# EAGLE design Logomatic-v23 (EAGLE 6.2)

## Sheet 1 of 2
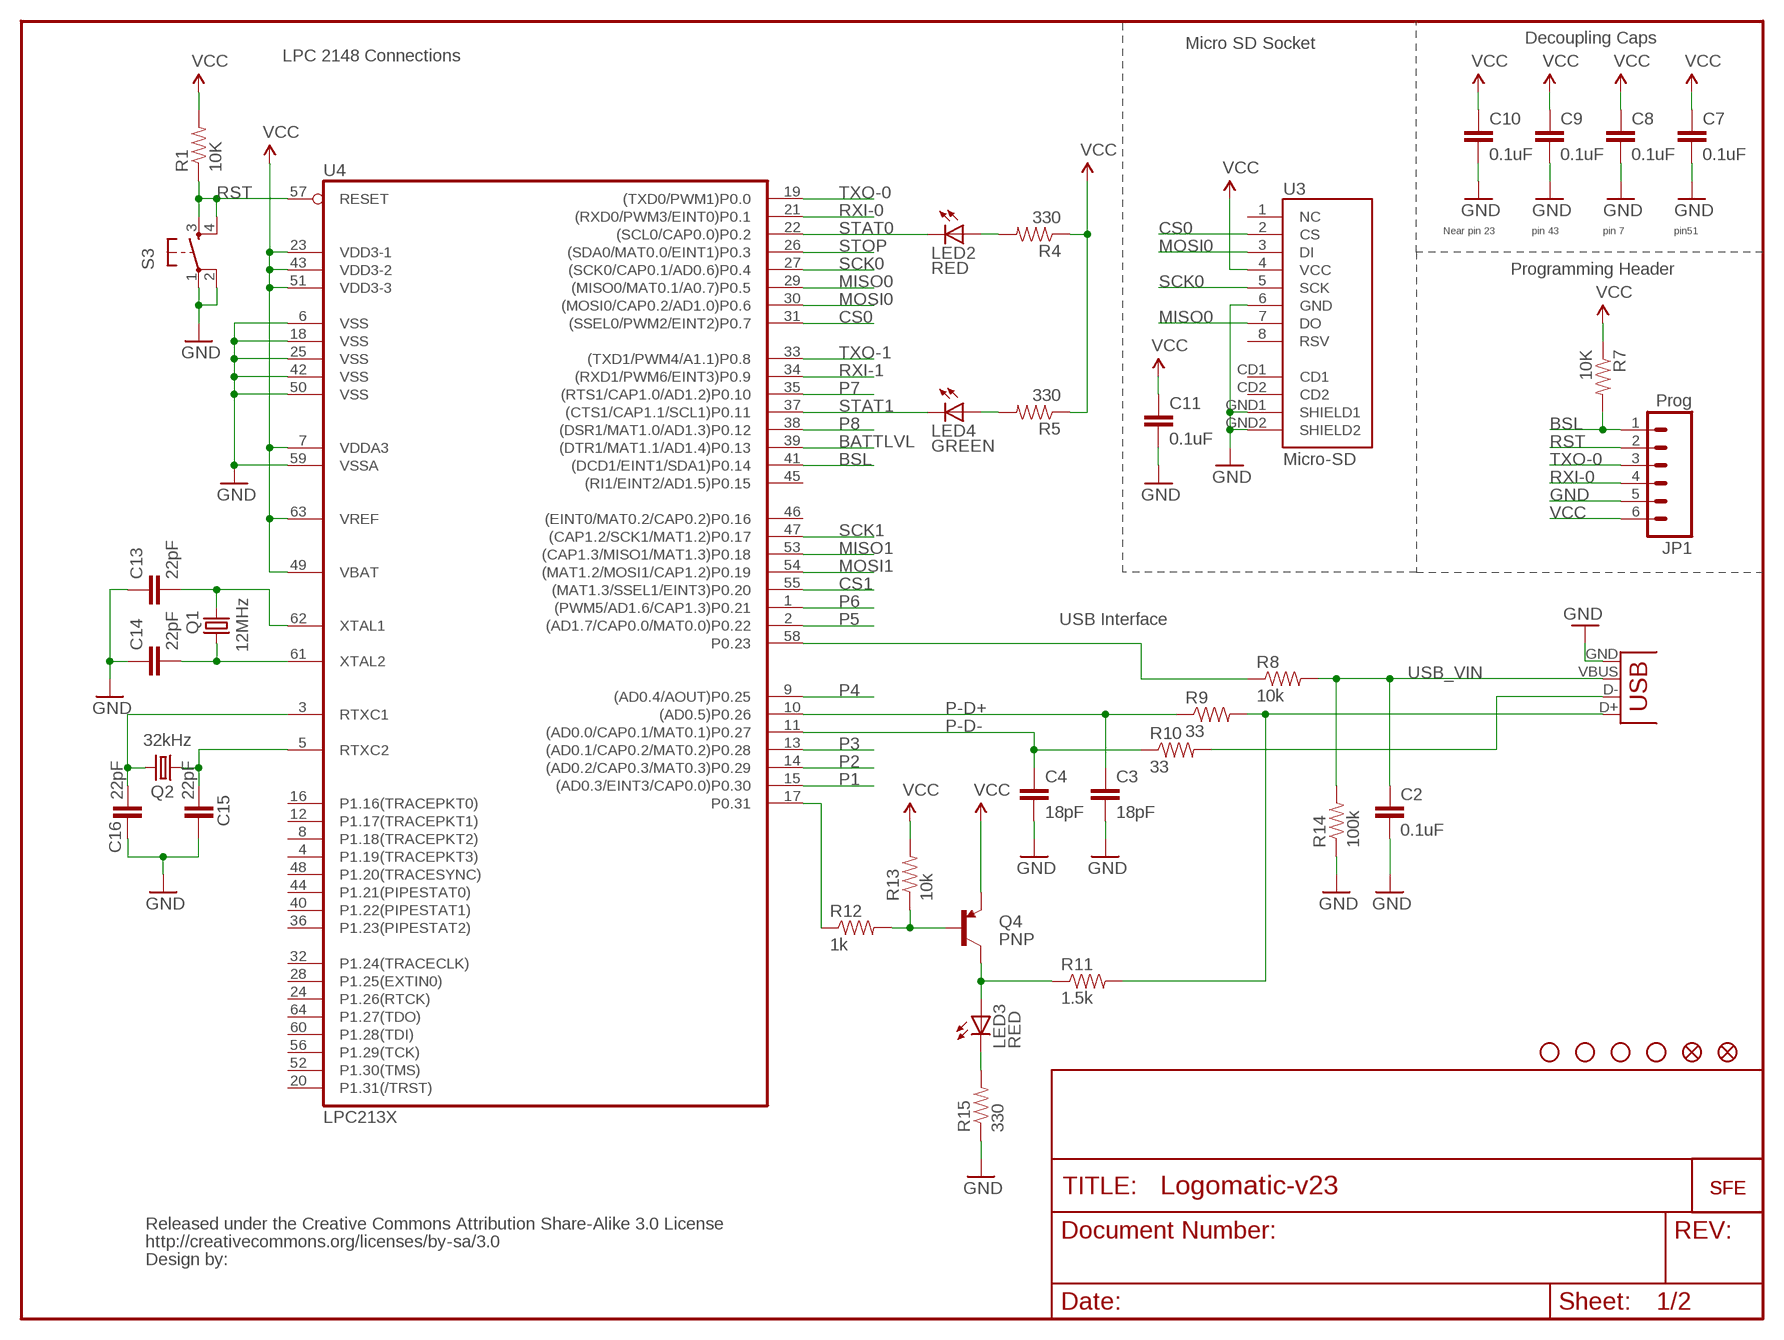
[diagram p0: schematic, sheet 1]

### Parts
C2  0.1uF  CAP0402  [C0402]
C3  18pF  CAP0402  [C0402]
C4  18pF  CAP0402  [C0402]
C7  0.1uF  CAP0402  [C0402]
C8  0.1uF  CAP0402  [C0402]
C9  0.1uF  CAP0402  [C0402]
C10  0.1uF  CAP0402  [C0402]
C11  0.1uF  CAP0402  [C0402]
C13  22pF  CAP0402  [C0402]
C14  22pF  CAP0402  [C0402]
C15  22pF  CAP0402  [C0402]
C16  22pF  CAP0402  [C0402]
JP1  Prog  M06SIP  [1X06]
LED2  RED  LED0603  [LED-0603]
LED3  RED  LED0603  [LED-0603]
LED4  GREEN  LED0603  [LED-0603]
Q1  12MHz  CRYSTAL5X3  [CRYSTAL-SMD-5X3]
Q2  32kHz  CRYSTAL32-SMD  [CRYSTAL-32KHZ-SMD]
Q4  PNP  TRANSISTOR_PNPSMD  [SOT23-3]
R1  10K  RESISTOR0402  [C0402]
R4  330  RESISTOR0402  [C0402]
R5  330  RESISTOR0402  [C0402]
R7  10K  RESISTOR0402  [C0402]
R8  10k  RESISTOR0402  [C0402]
R9  33  RESISTOR0402  [C0402]
R10  33  RESISTOR0402  [C0402]
R11  1.5k  RESISTOR0402  [C0402]
R12  1k  RESISTOR0402  [C0402]
R13  10k  RESISTOR0402  [C0402]
R14  100k  RESISTOR0402  [C0402]
R15  330  RESISTOR0402  [C0402]
S3  Reset  TAC_SWITCHSND  [TACTILE_SWITCH_SMD]
U3  Micro-SD  USD-SOCKETUSD  [USD-SOCKET-PP]
U4  LPC213X  [SQFP-S-10X10-64]
U$1  FIDUCIAL1X2  [FIDUCIAL-1X2]
U$2  FIDUCIAL1X2  [FIDUCIAL-1X2]
U$3  STAND-OFF  [STAND-OFF]
U$4  STAND-OFF  [STAND-OFF]
U$5  STAND-OFF  [STAND-OFF]
U$6  LOGO-SFENEW  [SFE-NEW-WEBLOGO]
U$7  LOGO-SFESK  [SFE-LOGO-FLAME]
U$8  STAND-OFF  [STAND-OFF]
U$9  CREATIVE_COMMONS  [CREATIVE_COMMONS]
X1  USBSMD  [USB-MINIB]

### Nets
BATTLVL: U4.39((DTR1/MAT1.1/AD1.4)P0.13) ; also sheet 2
BSL: JP1.1 R7.2 U4.41((DCD1/EINT1/SDA1)P0.14)
CS0: U3.2(CS) U4.31((SSEL0/PWM2/EINT2)P0.7)
CS1: U4.55((MAT1.3/SSEL1/EINT3)P0.20) ; also sheet 2
GND [power]: C2.2 C3.2 C4.2 C7.2 C8.2 C9.2 C10.2 C11.2 C13.1 C14.1 C15.1 C16.1 JP1.5 R14.1 R15.1 S3.1 S3.2 U3.6(GND) U3.GND1(SHIELD1) U3.GND2(SHIELD2) U4.6(VSS) U4.18(VSS) U4.25(VSS) U4.42(VSS) U4.50(VSS) U4.59(VSSA) X1.GND ; also sheet 2
MISO0: U3.7(DO) U4.29((MISO0/MAT0.1/A0.7)P0.5)
MISO1: U4.53((CAP1.3/MISO1/MAT1.3)P0.18) ; also sheet 2
MOSI0: U3.3(DI) U4.30((MOSI0/CAP0.2/AD1.0)P0.6)
MOSI1: U4.54((MAT1.2/MOSI1/CAP1.2)P0.19) ; also sheet 2
N$5: C13.2 Q1.3 U4.62(XTAL1)
N$6: C16.2 Q2.X2 U4.3(RTXC1)
N$7: LED2.A R4.2
N$9: C15.2 Q2.X1 U4.5(RTXC2)
N$16: R8.1 U4.58(P0.23)
N$17: Q4.1(B) R12.2 R13.1
N$19: LED4.A R5.2
N$21: C14.2 Q1.1 U4.61(XTAL2)
N$31: R12.1 U4.17(P0.31)
N$33: LED3.C R15.2
P1: U4.15((AD0.3/EINT3/CAP0.0)P0.30) ; also sheet 2
P2: U4.14((AD0.2/CAP0.3/MAT0.3)P0.29) ; also sheet 2
P3: U4.13((AD0.1/CAP0.2/MAT0.2)P0.28) ; also sheet 2
P4: U4.9((AD0.4/AOUT)P0.25) ; also sheet 2
P5: U4.2((AD1.7/CAP0.0/MAT0.0)P0.22) ; also sheet 2
P6: U4.1((PWM5/AD1.6/CAP1.3)P0.21) ; also sheet 2
P7: U4.35((RTS1/CAP1.0/AD1.2)P0.10) ; also sheet 2
P8: U4.38((DSR1/MAT1.0/AD1.3)P0.12) ; also sheet 2
P-D+: C3.1 R9.1 U4.10((AD0.5)P0.26)
P-D-: C4.1 R10.1 U4.11((AD0.0/CAP0.1/MAT0.1)P0.27)
RST: JP1.2 R1.1 S3.3 S3.4 U4.57(RESET)
RXI-0: JP1.4 U4.21((RXD0/PWM3/EINT0)P0.1)
RXI-1: U4.34((RXD1/PWM6/EINT3)P0.9) ; also sheet 2
SCK0: U3.5(SCK) U4.27((SCK0/CAP0.1/AD0.6)P0.4)
SCK1: U4.47((CAP1.2/SCK1/MAT1.2)P0.17) ; also sheet 2
STAT: LED3.A Q4.3(C) R11.1
STAT0: LED2.C U4.22((SCL0/CAP0.0)P0.2)
STAT1: LED4.C U4.37((CTS1/CAP1.1/SCL1)P0.11)
STOP: U4.26((SDA0/MAT0.0/EINT1)P0.3) ; also sheet 2
TXO-0: JP1.3 U4.19((TXD0/PWM1)P0.0)
TXO-1: U4.33((TXD1/PWM4/A1.1)P0.8) ; also sheet 2
USB_D+: R9.2 R11.2 X1.D+
USB_D-: R10.2 X1.D-
USB_VIN: C2.1 R8.2 R14.2 X1.VBUS ; also sheet 2
VCC: C7.1 C8.1 C9.1 C10.1 C11.1 JP1.6 Q4.2(E) R1.2 R4.1 R5.1 R7.1 R13.2 U3.4(VCC) U4.7(VDDA3) U4.23(VDD3-1) U4.43(VDD3-2) U4.49(VBAT) U4.51(VDD3-3) U4.63(VREF) ; also sheet 2
Unconnected: U3.1(NC) U3.8(RSV) U3.CD1 U3.CD2 U4.4(P1.19(TRACEPKT3)) U4.8(P1.18(TRACEPKT2)) U4.12(P1.17(TRACEPKT1)) U4.16(P1.16(TRACEPKT0)) U4.20(P1.31(/TRST)) U4.24(P1.26(RTCK)) U4.28(P1.25(EXTIN0)) U4.32(P1.24(TRACECLK)) U4.36(P1.23(PIPESTAT2)) U4.40(P1.22(PIPESTAT1)) U4.44(P1.21(PIPESTAT0)) U4.45((RI1/EINT2/AD1.5)P0.15) U4.46((EINT0/MAT0.2/CAP0.2)P0.16) U4.48(P1.20(TRACESYNC)) U4.52(P1.30(TMS)) U4.56(P1.29(TCK)) U4.60(P1.28(TDI)) U4.64(P1.27(TDO))

### Notes on the sheet
- Decoupling Caps
- Micro SD Socket
- LPC 2148 Connections
- Near pin 23 | pin 43 | pin 7 | pin51
- Programming Header
- USB Interface

## Sheet 2 of 2
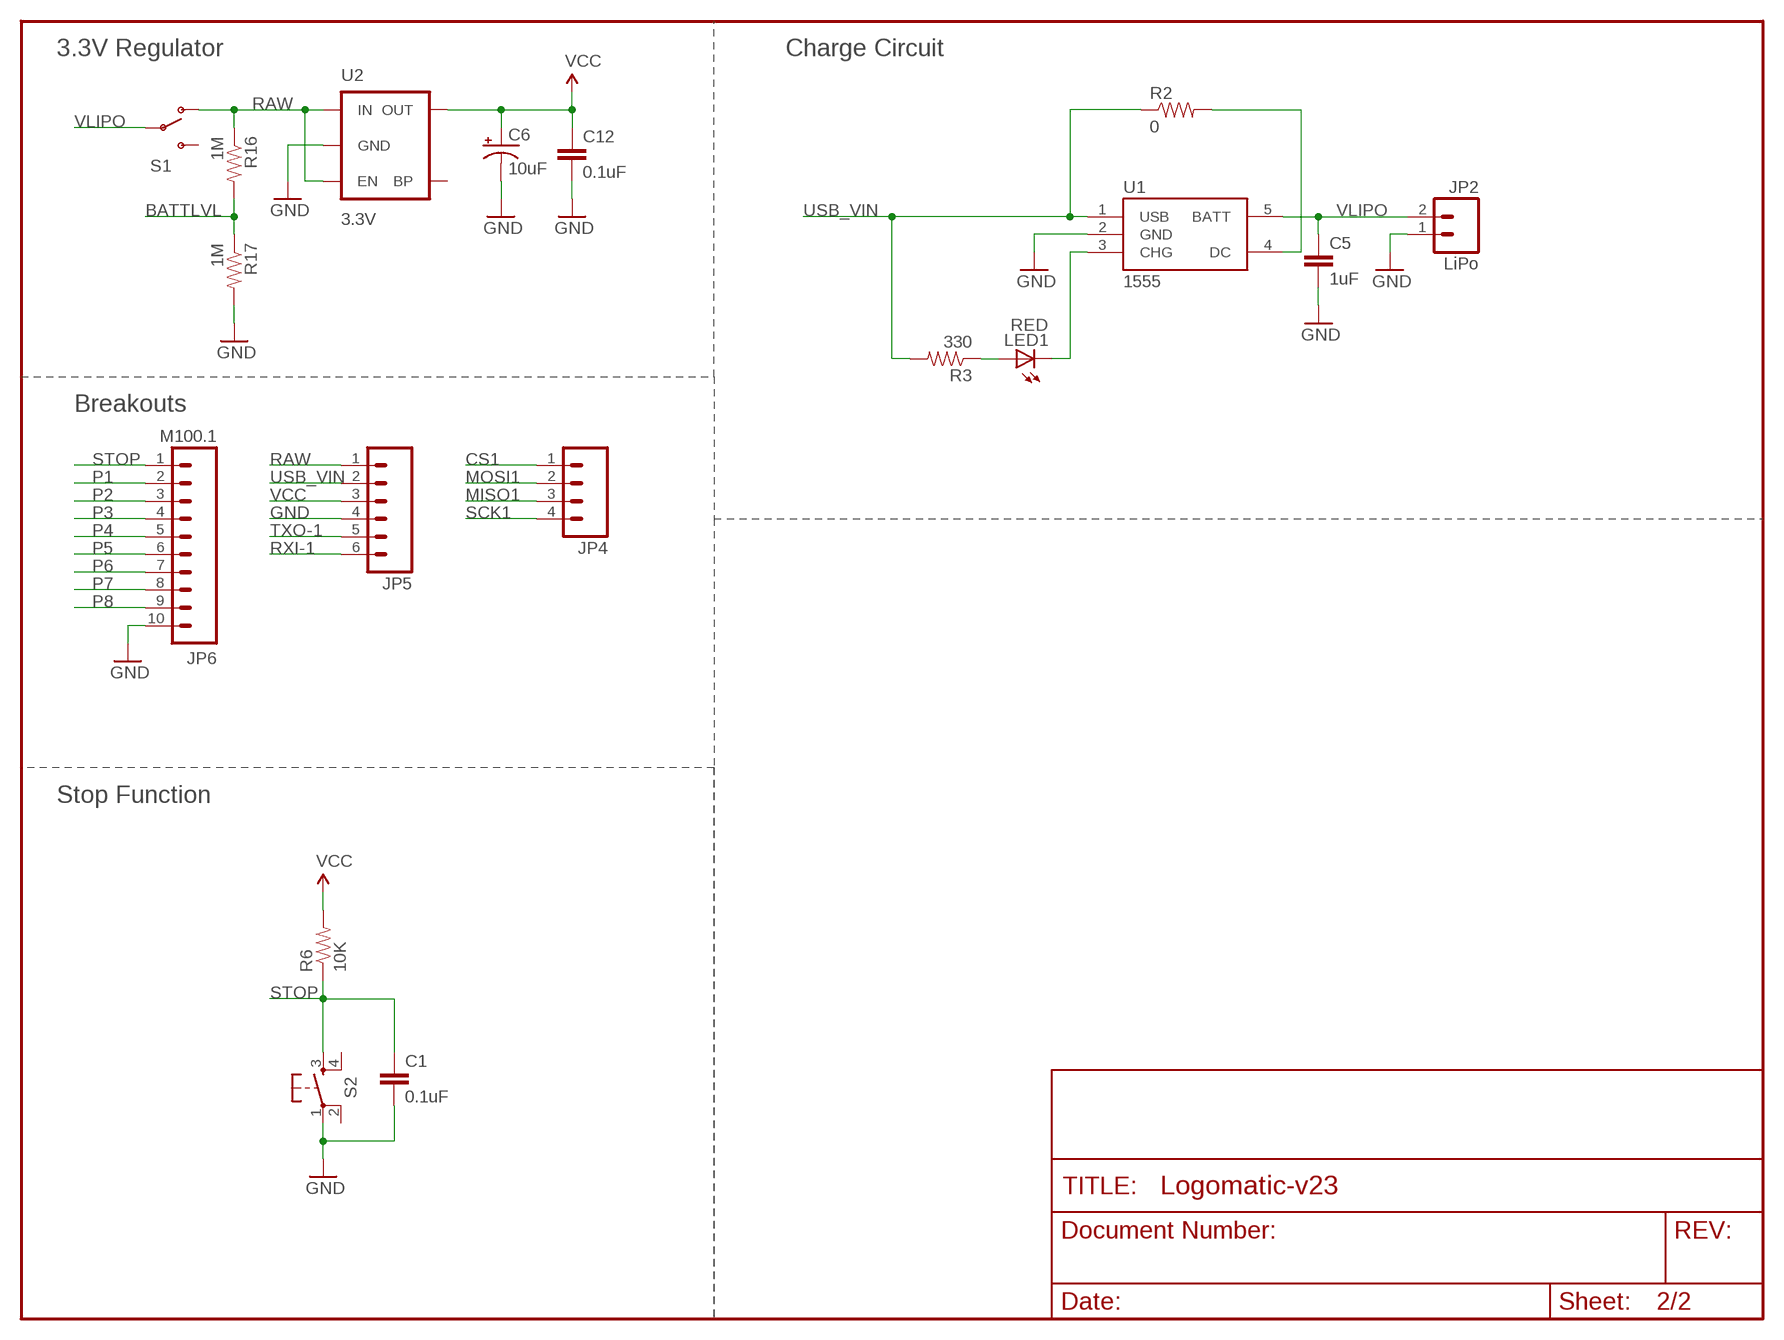
[diagram p1: schematic, sheet 2]

### Parts
C1  0.1uF  CAP0402  [C0402]
C5  1uF  CAP0402  [C0402]
C6  10uF  CAP_POL1206  [EIA3216]
C12  0.1uF  CAP0402  [C0402]
JP2  LiPo  M02-JST-2MM-SMT  [S2B-PH]
JP4  M04PTH  [1X04]
JP5  M06SIP  [1X06]
JP6  M100.1  [1X10]
LED1  RED  LED0603  [LED-0603]
R2  0  RESISTOR0402  [C0402]
R3  330  RESISTOR0402  [C0402]
R6  10K  RESISTOR0402  [C0402]
R16  1M  RESISTOR0402  [C0402]
R17  1M  RESISTOR0402  [C0402]
S1  SWITCH-SPSTSMD  [AYZ0202]
S2  Stop  TAC_SWITCHSND  [TACTILE_SWITCH_SMD]
U1  1555  MAX1555  [SOT23-5]
U2  3.3V  V_REG_LDOSMD  [SOT23-5]

### Nets
BATTLVL: R16.2 R17.1 ; also sheet 1
CS1: JP4.1 ; also sheet 1
GND [power]: C1.2 C5.2 C6.C(-) C12.2 JP2.1 JP5.4 JP6.10 R17.2 S2.1 U1.2(GND) U2.2(GND) ; also sheet 1
MISO1: JP4.3 ; also sheet 1
MOSI1: JP4.2 ; also sheet 1
N$2: R2.2 U1.4(DC)
N$12: LED1.C U1.3(CHG)
N$13: LED1.A R3.1
P1: JP6.2 ; also sheet 1
P2: JP6.3 ; also sheet 1
P3: JP6.4 ; also sheet 1
P4: JP6.5 ; also sheet 1
P5: JP6.6 ; also sheet 1
P6: JP6.7 ; also sheet 1
P7: JP6.8 ; also sheet 1
P8: JP6.9 ; also sheet 1
RAW: JP5.1 R16.1 S1.1(O) U2.1(IN) U2.3(EN)
RXI-1: JP5.6 ; also sheet 1
SCK1: JP4.4 ; also sheet 1
STOP: C1.1 JP6.1 R6.1 S2.3 ; also sheet 1
TXO-1: JP5.5 ; also sheet 1
USB_VIN: JP5.2 R2.1 R3.2 U1.1(USB) ; also sheet 1
VCC: C6.A(+) C12.1 JP5.3 R6.2 U2.5(OUT) ; also sheet 1
VLIPO [power]: C5.1 JP2.2 S1.2(P) U1.5(BATT)
Unconnected: S1.3(S) S2.2 S2.4 U2.4(BP)

### Notes on the sheet
- 3.3V Regulator | Charge Circuit
- Breakouts
- Stop Function

## Library data of the parts
C1-C4 C7-C16 = SparkFunEagle-6-6-07:CAP: Capacitor Standard 0603 ceramic capacitor, and 0.1" leaded capacitor.
C5 = SparkFun:CAP: Capacitor Standard 0603 ceramic capacitor, and 0.1" leaded capacitor.
C6 = SparkFun:CAP_POL: Capacitor Polarized These are standard SMD and PTH capacitors. Normally 10uF, 47uF, and 100uF in electrolytic and tantalum varieties. Always verify the external diameter of the through hole cap, it varies with capacity, voltage, and manufacturer. The EIA devices should be standard.
JP1 JP5 = SparkFun:M06: Header 6 Standard 6-pin 0.1" header. Use with straight break away headers (SKU : PRT-00116), right angle break away headers (PRT-00553), swiss pins (PRT-00743), machine pins (PRT-00117), and female headers (PRT-00115). Molex polarized connector foot print use with SKU : PRT-08094 with associated crimp pins and housings.
JP2 = SparkFun:M02: Header 2 Standard 2-pin 0.1" header. Use with straight break away headers (SKU : PRT-00116), right angle break away headers (PRT-00553), swiss pins (PRT-00743), machine pins (PRT-00117), and female headers (PRT-00115). Molex polarized connector foot print use with SKU : PRT-08233 with associated crimp pins and housings.
JP4 = SparkFun:M04: Header 4 Standard 4-pin 0.1" header. Use with straight break away headers (SKU : PRT-00116), right angle break away headers (PRT-00553), swiss pins (PRT-00743), machine pins (PRT-00117), and female headers (PRT-00115). Molex polarized connector foot print use with SKU : PRT-08231 with associated crimp pins and housings.
JP6 = SparkFun:M10: Header 10 Standard 10-pin 0.1" header. Use with straight break away headers (SKU : PRT-00116), right angle break away headers (PRT-00553), swiss pins (PRT-00743), machine pins (PRT-00117), and female headers (PRT-00115).
LED1 = SparkFun:LED: LEDs Standard schematic elements and footprints for 5mm, 3mm, 1206, and 0603 sized LEDs. 5mm - Spark Fun Electronics SKU : COM-00529 (and others)
LED2 LED4 = SparkFunEagle-6-6-07:LED: LEDs Standard schematic elements and footprints for 5mm, 3mm, 1206, and 0603 sized LEDs. 5mm - Spark Fun Electronics SKU : COM-00529 (and others)
LED3 = SparkFun_Master:LED
Q1 = SparkFunEagle-6-6-07:CRYSTAL: Crystals Various standard crystals. Proven footprints. Spark Fun Electronics SKU : COM-00534
Q2 = SparkFun:CRYSTAL: Crystals Various standard crystals. Proven footprints. Spark Fun Electronics SKU : COM-00534
Q4 = SparkFun:TRANSISTOR_PNP
R1 R4-R15 = SparkFunEagle-6-6-07:RESISTOR: Resistor Basic schematic elements and footprints for 0603, 1206, and PTH 1/10th watt (small) resistors.
R2 R3 R16 R17 = SparkFun:RESISTOR: Resistor Basic schematic elements and footprints for 0603, 1206, and PTH 1/10th watt (small) resistors.
S1 = SparkFun:SWITCH-SPST: SPST Switch Simple slide switch. Spark Fun Electronics SKU : COM-00102
S2 S3 = SparkFunEagle-6-6-07:TAC_SWITCH: Momentary Switch Button commonly used for reset or general input. Spark Fun Electronics SKU : COM-00097
U1 = SparkFun:MAX1555: MAX1555 Lithium Charger IC SOT-23 Lithium Polymer charging IC. Schematic element and footprint proven. Spark Fun Electronics SKU : COM-00674
U2 = SparkFun:V_REG_LDO: Voltage Regulator LDO Standard 150mA LDO voltage regulator in SOT-23 layout. Micrel part MIC5205. BP (by-pass) pin is used to lower output noise with 470pF cap.
U3 = SparkFun:USD-SOCKET: microSD Socket Push-push type uSD socket. Schematic element and footprint production proven. Spark Fun Electronics SKU : PRT-00127. tDoc lines correctly indicate media card edge positions when inserting (unlocked, locked, depressed).
U4 = SparkFun:LPC213X: LPC213x Schematic element and footprint for NXP LPC213x. Spark Fun Electronics SKU : COM-00520
U$1 U$2 = SparkFun:FIDUCIAL: Fiducial Alignment Points Various fiducial points for machine vision alignment.
U$3-U$5 U$8 = SparkFun:STAND-OFF: Stand Off This is the mechanical footprint for a #4 phillips button head screw. Use the keepout ring to avoid running the screw head into surrounding components. SKU : PRT-00447
U$6 U$7 = SparkFun:LOGO-SFE: Spark Fun Electronics PCB Logo This is the standard Spark Fun Electronics PCB logo.
U$9 = SparkFun:CREATIVE_COMMONS
X1 = SparkFun:USB: USB Connectors USB-B-PTH is fully proven SKU : PRT-00139 USB-miniB is fully proven SKU : PRT-00587 USB-A-PCB is untested. USB-A-H is throughly reviewed, but untested. Spark Fun Electronics SKU : PRT-00437 USB-B-SMT is throughly reviewed, but untested. Needs silkscreen touching up. USB-A-S has not been used/tested USB-MB-H has not been used/tested

## Net classes
0 default: width 0.178 mm
1 power: width 0.203 mm
2 hv: width 0.254 mm, clearance 0.229 mm

## Board
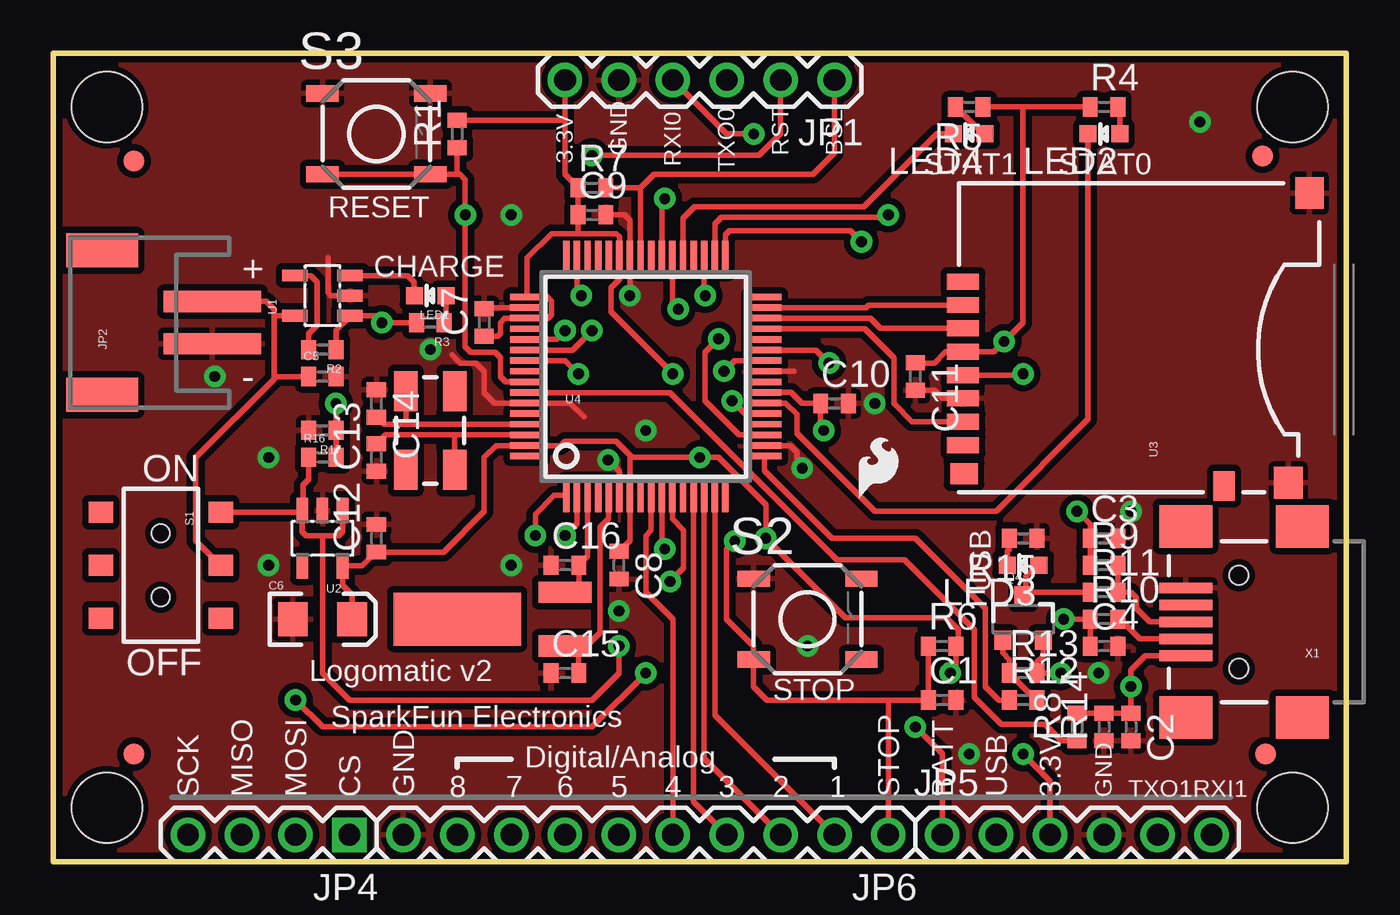
[diagram p2: board, top side]
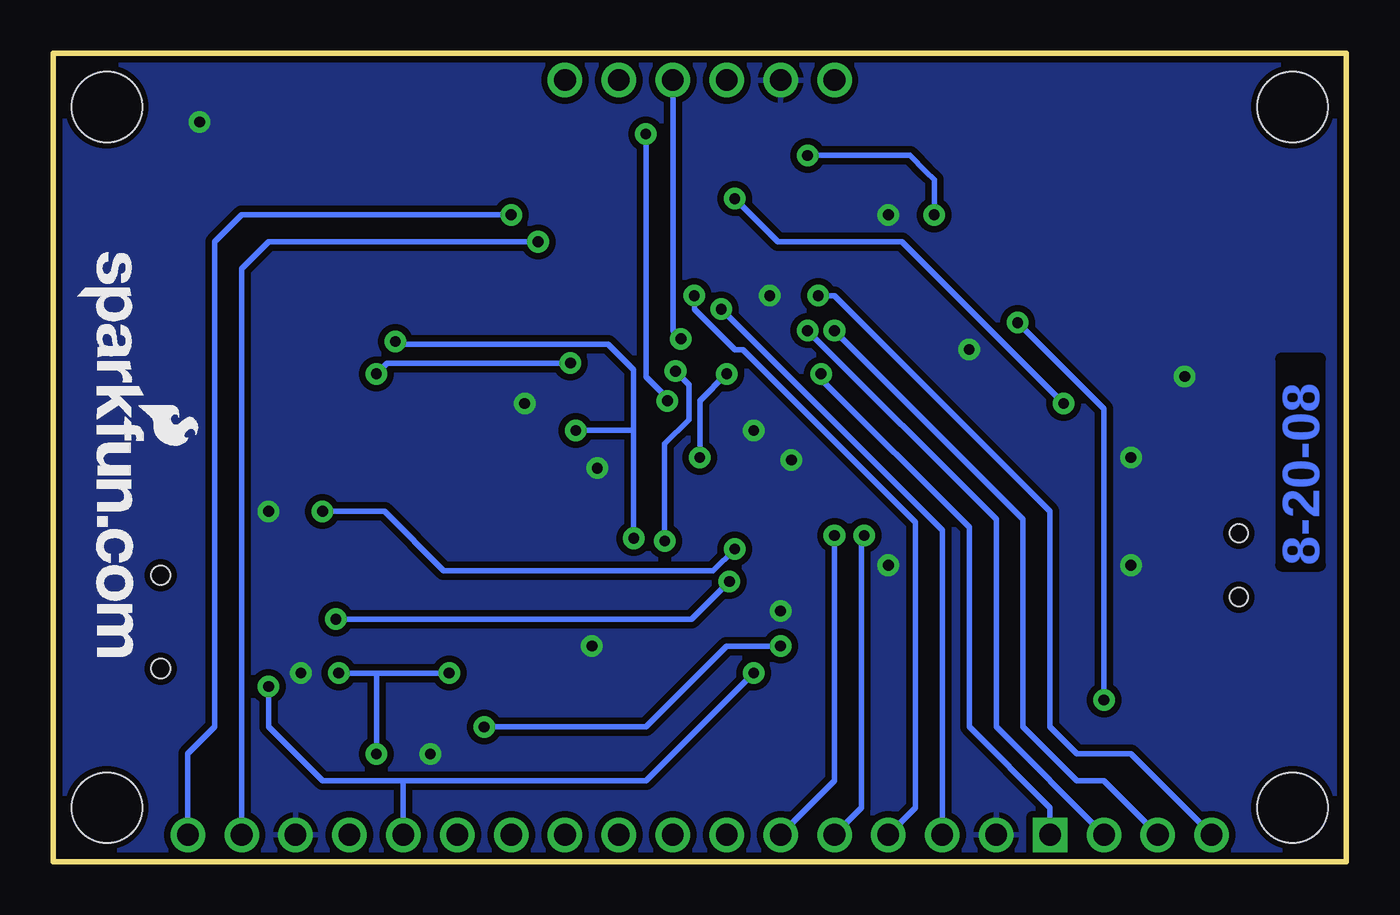
[diagram p3: board, bottom side, seen from below]

Size 60.96 x 38.1 mm. Coordinates in mm from the lower left corner, seen from the top.
Outline: 0,0 60.96,0 60.96,38.1 0,38.1 0,0
Copper layers (1*16): Top 0.035mm / dielectric 1.5mm / Bottom 0.035mm
Design rules: minimum track width 8mil, minimum drill 20mil, track to track 8mil, track to pad 8mil, pad to pad 7mil, via to via 8mil, smd to smd 8mil, copper to edge 10mil, drill to drill 8mil, minimum pad ring 12mil, minimum via ring 10mil, stop-mask expansion 4mil, vias tented up to drill 20mil, thermal gap 10mil

### Footprints (pad centres in the part's own frame; a part is rotated, then mirrored left to right if it is on the bottom)
C0402 = smd 0.7 x 0.9: 1 -0.65,0; 2 0.65,0
EIA3216 = smd 1.4 x 1.6: A 1.4,0; C -1.4,0
FIDUCIAL-1X2 = smd 1 x 1: 1 0,0
1X06 = drill 1.016: 1 0,0; 2 2.54,0; 3 5.08,0; 4 7.62,0; 5 10.16,0; 6 12.7,0
S2B-PH = smd 1 x 4.6: 1 -1,-3.7; 2 1,-3.7 | smd 1.6 x 3.4: NC1 -3.4,1.5; NC2 3.4,1.5
1X04 = drill 1.016 square: 1 0,0 | drill 1.016: 2 2.54,0; 3 5.08,0; 4 7.62,0
1X10 = drill 1.016: 1 0,0; 2 2.54,0; 3 5.08,0; 4 7.62,0; 5 10.16,0; 6 12.7,0; 7 15.24,0; 8 17.78,0; 9 20.32,0; 10 22.86,0
LED-0603 = smd 0.8 x 0.8: A 0,-0.75; C 0,0.75
CRYSTAL-SMD-5X3 = smd 1.9 x 1.1: 1 -1.85,-1.15; 2 1.85,-1.15; 3 1.85,1.15; 4 -1.85,1.15
CRYSTAL-32KHZ-SMD = smd 2.5 x 6: SHEILD 0,5.08 | smd 1 x 2.5: X1 -1.27,0; X2 1.27,0
SOT23-3 = smd 0.8 x 0.9: 1 -0.95,-1; 2 0.95,-1; 3 0,1.1
AYZ0202 = smd 1 x 1.15: 1 -2.5,2.825; 2 0,2.825; 3 2.5,2.825; 4 -2.5,-2.825; 5 0,-2.825; 6 2.5,-2.825 | hole 0.85: 1.5,0; -1.5,0
TACTILE_SWITCH_SMD = smd 1.524 x 0.762: 1 -2.54,1.905; 2 2.54,1.905; 3 -2.54,-1.905; 4 2.54,-1.905
SOT23-5 = smd 0.55 x 1.2: 1 -0.95,-1.3; 2 0,-1.3; 3 0.95,-1.3; 4 0.95,1.3; 5 -0.95,1.3
USD-SOCKET-PP = smd 0.75 x 1.5: 1 3.2,16.8; 2 2.1,16.8; 3 1,16.8; 4 -0.1,16.8; 5 -1.2,16.8; 6 -2.3,16.8; 7 -3.4,16.8; 8 -4.5,16.8 | smd 1 x 1.3: CD1 -5.85,16.75 | smd 1.4 x 1: CD2 -6.425,4.5 | smd 1.5 x 1.35: GND1 -6.275,1.475; GND2 7.375,0.475
SQFP-S-10X10-64 = smd 0.3 x 1.6: 1 -3.75,-5.6; 2 -3.25,-5.6; 3 -2.75,-5.6; 4 -2.25,-5.6; 5 -1.75,-5.6; 6 -1.25,-5.6; 7 -0.75,-5.6; 8 -0.25,-5.6; 9 0.25,-5.6; 10 0.75,-5.6; 11 1.25,-5.6; 12 1.75,-5.6; 13 2.25,-5.6; 14 2.75,-5.6; 15 3.25,-5.6; 16 3.75,-5.6; 33 3.75,5.6; 34 3.25,5.6; 35 2.75,5.6; 36 2.25,5.6; 37 1.75,5.6; 38 1.25,5.6; 39 0.75,5.6; 40 0.25,5.6; 41 -0.25,5.6; 42 -0.75,5.6; 43 -1.25,5.6; 44 -1.75,5.6; 45 -2.25,5.6; 46 -2.75,5.6; 47 -3.25,5.6; 48 -3.75,5.6 | smd 1.6 x 0.3: 17 5.6,-3.75; 18 5.6,-3.25; 19 5.6,-2.75; 20 5.6,-2.25; 21 5.6,-1.75; 22 5.6,-1.25; 23 5.6,-0.75; 24 5.6,-0.25; 25 5.6,0.25; 26 5.6,0.75; 27 5.6,1.25; 28 5.6,1.75; 29 5.6,2.25; 30 5.6,2.75; 31 5.6,3.25; 32 5.6,3.75; 49 -5.6,3.75; 50 -5.6,3.25; 51 -5.6,2.75; 52 -5.6,2.25; 53 -5.6,1.75; 54 -5.6,1.25; 55 -5.6,0.75; 56 -5.6,0.25; 57 -5.6,-0.25; 58 -5.6,-0.75; 59 -5.6,-1.25; 60 -5.6,-1.75; 61 -5.6,-2.25; 62 -5.6,-2.75; 63 -5.6,-3.25; 64 -5.6,-3.75
STAND-OFF = hole 3.302: 0,0
USB-MINIB = smd 2.5 x 0.5: D+ 2.5,0; D- 2.5,0.8; GND 2.5,-1.6; ID 2.5,-0.8; VBUS 2.5,1.6 | smd 2.5 x 2: GND@1 -3,-4.5; GND@2 -3,4.5; GND@3 2.5,4.5; GND@4 2.5,-4.5 | hole 0.9: 0,2.2; 0,-2.2

### Placement (x,y rotation side)
C1  41.91,7.62 0 top
C2  50.8,6.35 270 top
C3  49.53,15.24 0 top
C4  49.53,10.16 0 top
C5  12.7,22.86 0 top
C6  12.7,11.43 0 top
C7  20.32,25.4 90 top
C8  26.67,13.97 270 top
C9  25.4,30.48 0 top
C10  36.83,21.59 0 top
C11  40.64,22.86 270 top
C12  15.24,15.24 90 top
C13  15.24,19.05 90 top
C14  15.24,21.59 270 top
C15  24.13,8.89 0 top
C16  24.13,13.97 0 top
E$1  [FIDUCIAL-1X2]  57,33.25 0 top
E$2  [FIDUCIAL-1X2]  3.81,5.08 0 top
JP1  36.83,36.83 180 top
JP2  3.81,25.4 90 top
JP4  13.97,1.27 180 top
JP5  41.91,1.27 0 top
JP6  39.37,1.27 180 top
LED1  17.78,26.67 90 top
LED2  49.53,34.29 90 top
LED3  45.72,13.97 90 top
LED4  43.18,34.29 90 top
Q1  17.78,20.32 270 top
Q2  24.13,11.43 90 top
Q4  45.72,11.43 0 top
R1  19.05,34.29 90 top
R2  12.7,24.13 180 top
R3  17.78,25.4 180 top
R4  49.53,35.56 0 top
R5  43.18,35.56 180 top
R6  41.91,10.16 0 top
R7  25.4,31.75 0 top
R8  48.26,6.35 90 top
R9  49.53,13.97 0 top
R10  49.53,11.43 0 top
R11  49.53,12.7 0 top
R12  45.72,7.62 0 top
R13  45.72,8.89 0 top
R14  49.53,6.35 90 top
R15  45.72,15.24 180 top
R16  12.7,19.05 0 top
R17  12.7,20.32 180 top
S1  5.08,13.97 270 top
S2  35.56,11.43 0 top
S3  15.24,34.29 0 top
U1  12.7,26.67 90 top
U2  12.7,15.24 180 top
U3  59.69,24.13 90 top
U4  27.94,22.86 0 top
U$1  57.15,5.08 0 top
U$2  3.81,33.02 0 top
U$3  2.54,2.54 0 top
U$4  58.42,2.54 0 top
U$5  2.54,35.56 0 top
U$6  59.82,28.7 270 bottom
U$7  37.97,17.14 0 top
U$8  58.42,35.56 0 top
U$9  17.78,-12.7 0 top  (outside the outline)
X1  55.88,11.3 180 top

### Tracks (layer width: path | path; a pad name or v marks a point on that pad's centre or on a via)
BATTLVL  (via drill 0.51)
  Top 0.254: R16.2 13.35,20.3 13.34,20.32 R17.1 13.35,21.57 v13.34,21.59 | U4.39 28.69,31.1 v28.83,31.24
  Bottom 0.254: v28.83,31.24 26.8,29.21 20.95,29.21 v13.34,21.59
BSL
  Top 0.254: U4.41 27.69,28.45 27.69,31.75 | JP1.1 36.83,33.4 35.81,32.38 28.32,32.38 27.69,31.75 | 27.69,31.75 R7.2
CS0
  Top 0.254: U4.31 38.3,26.11 38.42,26.23 U3.2
CS1  (via drill 0.51)
  Top 0.254: U4.55 24.14,23.61 v24.77,22.99
  Bottom 0.254: JP4.1 13.97,2.54 17.78,6.35 17.78,15.75 24.77,22.73 v24.77,22.99
GND  (via drill 0.51)
  Top 0.254: U4.25 34.92,23.11 | v27.18,26.67 27.19,26.68 U4.42 27.19,30.21 26.92,30.48 C9.2 26.04,30.48 | C7.2 20.34,26.05 20.45,26.16 20.5,26.11 U4.50 | U1.2 13.08,26.67 12.95,26.8 12.95,28.45 | U4.6 26.69,18.39 26.42,18.67 | U4.18 34.75,19.61 35.05,19.3 35.05,18.8 v35.31,18.54 | 25.02,20.95 24.36,21.61 U4.59 20.81,21.61 20.32,22.1 20.32,23.11 19.94,23.5 19.18,23.5 18.8,23.88 | U3.6 41.92,21.83 41.53,22.23 40.64,22.23 C11.2
  other vias: 26.67,11.81 54.05,34.85 17.78,24.13 21.59,30.48 49.28,8.89 35.56,10.16 27.94,20.32 10.16,13.97 26.16,18.92 38.73,21.59 21.59,13.97 7.62,22.86 43.18,5.08 50.8,16.51 10.16,19.05
  pour Top (isolate 0.305): 0,0 60.96,0 60.96,38.1 0,38.1
  pour Bottom (isolate 0.305): 0,0 60.96,0 60.96,38.1 0,38.1
MISO0
  Top 0.254: U4.29 38.26,25.11 39.62,23.75 39.62,21.59 40.48,20.73 U3.7
MISO1  (via drill 0.51)
  Top 0.254: U4.53 23.72,24.61 v24.13,25.02
  Bottom 0.254: JP4.3 11.43,3.81 12.7,3.81 15.24,6.35 15.24,16.13 v24.13,25.02
MOSI0
  Top 0.254: U3.3 39.01,25.13 38.52,25.61 U4.30
MOSI1  (via drill 0.51)
  Top 0.254: U4.54 24.49,24.11 v25.4,25.02
  Bottom 0.254: JP4.2 16.51,6.35 16.51,16.13 v25.4,25.02
N$2
  Top 0.254: U1.4 12.13,27.62 12.45,27.3 12.45,25.27 12.05,24.88 R2.2
N$5
  Top 0.254: C13.2 15.24,19.68 15.66,20.11 18.92,20.11 | 18.92,20.11 U4.62 | 18.92,20.11 18.92,20.07 18.93,20.06 Q1.3
N$6
  Top 0.254: U4.3 25.19,14.39 24.77,13.97 C16.2 24.78,12.84 24.64,12.7 Q2.X2
N$7
  Top 0.254: R4.2 50.04,35.56 50.28,35.32 LED2.A
N$9
  Top 0.254: U4.5 26.19,16.16 25.78,15.75 25.78,10.79 25.15,10.16 24.89,10.16 | 24.89,10.16 24.77,10.16 24.77,10.03 | 24.77,10.03 24.78,10.02 | C15.2 24.77,8.89 24.77,10.03 | 24.89,10.16 Q2.X1
N$12
  Top 0.254: U1.3 16.7,27.62 17.02,27.3 17.02,26.8 17.14,26.67 LED1.C
N$13
  Top 0.254: R3.1 18.41,25.4 18.53,25.52 LED1.A
N$16
  Top 0.254: U4.58 22.35,22.1 29.08,22.1 36.96,14.22 40.13,14.22 43.43,10.92 43.43,7.75 44.7,6.48 46.74,6.48 47.5,5.71 47.5,5.7 R8.1
N$17
  Top 0.254: Q4.1 44.77,9.84 45.09,9.53 45.09,8.89 | R13.1 45.09,8.89 | R12.2 46.35,7.62 45.09,8.89
N$19
  Top 0.254: LED4.A 43.81,34.29 42.55,35.56 R5.2
N$21
  Top 0.254: C14.2 15.24,20.95 15.59,20.61 16.64,20.61 | 16.64,20.61 U4.61 | 16.64,20.61 16.64,20.7 16.63,20.71 Q1.1
N$31
  Top 0.254: R12.1 44.58,7.62 43.94,8.26 43.94,11.94 41.91,13.97 40.64,15.24 36.7,15.24 33.53,18.41 33.53,19.05 33.54,19.06 U4.17
N$33
  Top 0.254: LED3.C 44.97,14.62 45.09,14.73 45.09,15.24 R15.2
P1
  Top 0.254: U4.15 31.19,6.91 JP6.2
P2
  Top 0.254: 30.69,17.36 U4.14 30.69,4.87 JP6.3
P3
  Top 0.254: U4.13 30.19,2.83 JP6.4
P4
  Top 0.254: U4.9 28.19,15.62 27.94,15.37 27.94,12.7 29.21,11.43 JP6.5
P5  (via drill 0.51)
  Top 0.254: U4.2 24.69,15.93 v24.13,15.37
  Bottom 0.254: v24.13,15.37 24.13,3.81 JP6.6
P6  (via drill 0.51)
  Top 0.254: 24.18,17.27 U4.1 23.61,17.26 22.73,16.38 v22.73,15.37
  Bottom 0.254: v22.73,15.37 22.86,15.24 22.86,2.54 JP6.7
P7  (via drill 0.51)
  Top 0.254: 30.69,28.49 U4.35 30.69,26.71 v30.73,26.67
  Bottom 0.254: v30.73,26.67 30.73,26.04 28.83,24.13 28.45,24.13 20.32,16 20.32,2.54 JP6.8
P8  (via drill 0.51)
  Top 0.254: U4.38 29.19,26.31 v29.46,26.04
  Bottom 0.254: JP6.9 19.05,15.62 v29.46,26.04
P-D+  (via drill 0.51)
  Top 0.254: v48.26,16.51 48.88,15.89 C3.1 48.9,15.24 48.88,15.22 R9.1 | U4.10 28.69,14.87 v28.83,14.73
  Bottom 0.254: v48.26,16.51 45.34,16.51 42.55,13.72 29.84,13.72 v28.83,14.73
P-D-  (via drill 0.51)
  Top 0.254: U4.11 29.19,16.15 29.72,15.62 29.72,13.84 v29.08,13.21 | 48.77,10.03 48.9,10.16 C4.1 48.88,11.41 48.9,11.43 | 48.9,11.43 R10.1 | v47.62,11.43 48.9,11.43
  Bottom 0.254: v47.62,11.43 30.86,11.43 v29.08,13.21
RAW  (via drill 0.51)
  Top 0.254: 11.78,16.54 11.81,16.51 11.77,16.47 S1.1 | 11.78,16.54 U2.3 11.75,15.55 11.94,15.37 12.7,15.37 | U2.1 13.65,15.55 13.46,15.37 12.7,15.37 | v26.67,10.16 26.67,8.89 25.4,7.62 13.97,7.62 12.7,8.89 12.7,15.37 | JP5.1 41.91,5.08 v40.64,6.35 | 11.78,16.54 11.78,17.75 12.05,18.02 R16.1
  Bottom 0.254: v40.64,6.35 33.02,6.35 29.21,10.16 v26.67,10.16
RST  (via drill 0.51)
  Top 0.254: U4.57 22.1,22.61 21.34,22.61 21.08,22.86 21.08,23.75 20.83,24 19.68,24 19.43,24.26 v19.43,30.48 19.43,32.13 19.18,32.38 19.05,32.38 | v25.4,33.27 33.27,33.27 34.29,34.29 JP1.2 | S3.3 S3.4 19.05,32.38 | 19.05,32.38 R1.1
  Bottom 0.254: v25.4,33.27 20.57,33.27 19.81,32.51 19.43,32.13 v19.43,30.48
RXI-0  (via drill 0.51)
  Top 0.254: U4.21 32.61,21.11 v32,21.72 | v33.02,34.29 31.75,34.29 JP1.4
  Bottom 0.254: v32,21.72 32,21.84 33.02,22.86 v33.02,34.29
RXI-1  (via drill 0.51)
  Top 0.254: U4.34 31.19,30.05 31.5,30.35 39.24,30.35 v39.37,30.48
  Bottom 0.254: v39.37,30.48 52.07,30.48 53.34,29.21 53.34,6.35 54.61,5.08 JP5.6
SCK0  (via drill 0.51)
  Top 0.254: U3.5 45.66,22.93 v45.72,22.99 | U4.27 35.96,24.11 v36.58,23.5
  Bottom 0.254: v36.58,23.5 45.21,23.5 v45.72,22.99
SCK1  (via drill 0.51)
  Top 0.254: U4.47 24.69,26.87 v24.89,26.67
  Bottom 0.254: JP4.4 10.16,5.08 12.7,5.08 13.97,6.35 13.97,16.51 24.13,26.67 v24.89,26.67
STAT
  Top 0.254: Q4.3 45.72,12.57 45.85,12.7 | 45.85,12.7 R11.1 | LED3.A 46.35,13.97 45.85,13.46 45.85,12.7
STAT0
  Top 0.254: LED2.C 48.78,20.84 44.45,16.51 38.73,16.51 35.05,20.19 35.05,21.08 34.52,21.61 U4.22
STAT1
  Top 0.254: LED4.C 41.66,34.29 38.23,30.86 30.23,30.86 29.69,30.32 U4.37
STOP  (via drill 0.51)
  Top 0.254: U4.26 32.12,23.61 v31.62,23.11 | v32.13,15.11 31.75,14.73 31.75,11.43 33.02,10.16 S2.3 33.02,8.26 33.66,7.62 39.37,7.62 | 39.37,7.62 C1.1 41.27,7.62 41.26,7.63 R6.1 | JP6.1 39.37,7.62
  Bottom 0.254: v31.62,23.11 30.99,22.48 30.99,20.83 32.13,19.68 v32.13,15.11
TXO-0  (via drill 0.51)
  Top 0.254: U4.19 32.34,20.11 30.73,21.72 30.73,24 v31.37,24.64
  Bottom 0.254: JP1.3 31.75,25.02 v31.37,24.64
TXO-1  (via drill 0.51)
  Top 0.254: U4.33 31.69,29.53 31.88,29.72 37.59,29.72 v38.1,29.21
  Bottom 0.254: v38.1,29.21 50.8,29.21 52.07,27.94 JP5.5
USB_D+
  Top 0.254: R9.2 50.23,13.97 50.18,13.92 R11.2 | X1.D+ 51.69,11.3 51.05,11.94 51.05,12.45 50.8,12.7 R11.2 | R11.2 50.16,12.7
USB_D-
  Top 0.254: R10.2 50.29,11.43 51.22,10.5 X1.D-
USB_VIN  (via drill 0.51)
  Top 0.254: 48.26,6.99 R8.2 R14.2 | R14.2 49.64,7 49.66,6.99 | 50.8,7.11 C2.1 | R14.2 50.69,7 50.8,7.11 | X1.VBUS 51.49,9.7 50.8,9.02 v50.8,8.26 50.8,7.11 | R3.2 v15.49,25.4 15.17,25.72 U1.1 14,25.68 13.35,25.03 R2.1 | v11.43,7.62 12.7,6.35 25.4,6.35 v27.94,8.89
  Bottom 0.254: v11.43,7.62 11.43,21.34 v15.49,25.4 | v50.8,8.26 50.8,6.35 48.26,3.81 44.45,3.81 | 44.45,3.81 33.02,3.81 v27.94,8.89 | 44.45,3.81 JP5.2
VCC  (via drill 0.51)
  Top 0.254: 24.77,31.75 24.75,31.73 C9.1 24.75,29.61 24.77,29.59 | 24.77,29.59 23.5,29.59 22.35,28.45 22.35,26.67 22.34,26.66 U4.49 23.3,26.61 23.5,26.42 23.5,25.78 23.32,25.61 U4.51 21.29,25.61 21.08,25.4 21.08,24.89 20.95,24.77 20.32,24.77 C7.1 | 24.77,29.59 26.54,29.59 26.69,29.44 U4.43 26.69,27.45 26.29,27.05 26.29,25.91 v29.21,22.99 | U4.23 34.79,22.11 35.31,21.59 C10.1 36.18,20.46 v36.32,20.32 | 48.9,35.56 R4.1 45.72,35.56 | 45.72,35.56 R5.1 | 45.72,35.56 45.72,25.4 v44.83,24.51 44.35,24.03 U3.4 42.06,24.03 41.53,23.5 40.64,23.5 C11.1 | 24.77,31.75 R7.1 | 24.77,31.75 24.13,32.38 24.13,34.92 | Q4.2 46.67,9.71 46.37,9.41 R13.2 v47.5,8.89 | 14.1,11.3 14.22,11.18 | C6.A 14.1,11.3 | 14.1,11.3 14.1,12.57 13.65,13.02 U2.5 14.57,13.94 15.24,14.61 C12.1 18.4,14.59 20.32,16.51 20.32,19.05 20.88,19.61 U4.63 23.93,19.61 24.13,19.81 26.54,19.81 27.18,19.18 | C8.1 26.67,14.61 27.19,15.12 U4.7 27.19,19.16 27.18,19.18 | v42.29,8.89 42.56,9.16 R6.2 42.62,10.22 42.67,10.22 42.67,10.92 42.1,11.49 37.34,11.49 v33.59,15.24 33.59,16.83 31.37,19.05 v30.48,19.05 27.3,19.05 27.18,19.18 | 24.13,34.92 JP1.6 | R1.2 24.11,34.94 24.13,34.92 | JP5.3 46.99,3.81 v45.72,5.08
  Bottom 0.254: v33.59,15.24 33.59,20.32 | v42.29,8.89 45.72,8.89 | 45.72,8.89 v47.5,8.89 | 33.59,20.32 v36.32,20.32 | v44.83,24.51 44.7,24.38 34.8,24.38 33.59,23.18 33.59,20.32 | v30.48,19.05 30.48,21.72 v29.21,22.99 | 45.72,8.89 v45.72,5.08
VLIPO
  Top 0.254: JP2.2 10.05,26.4 10.41,26.04 10.41,25.78 | 10.41,22.86 10.41,25.78 | 10.41,22.86 C5.1 | U1.5 10.47,25.72 10.41,25.78 | 10.41,22.86 10.41,22.73 6.73,19.05 6.73,15.11 7.87,13.97 S1.2

### Text on the board
Bottom: 8-20-08
tPlace: 3.3V | GND | RXI0 | TXO0 | RST | BSL | STAT1 | STAT0 | RESET | CHARGE | + | - | ON | USB | OFF | Logomatic v2 | STOP | SparkFun Electronics | Digital/Analog | SCK | MISO | MOSI | CS | GND | 8 | 7 | 6 | 5 | 4 | 3 | 2 | 1 | STOP | BATT | USB | 3.3V | GND | TXO1 | RXI1
tValues: Horizontal JST